# Altium project PCB_ReflowOwen.PrjPcb
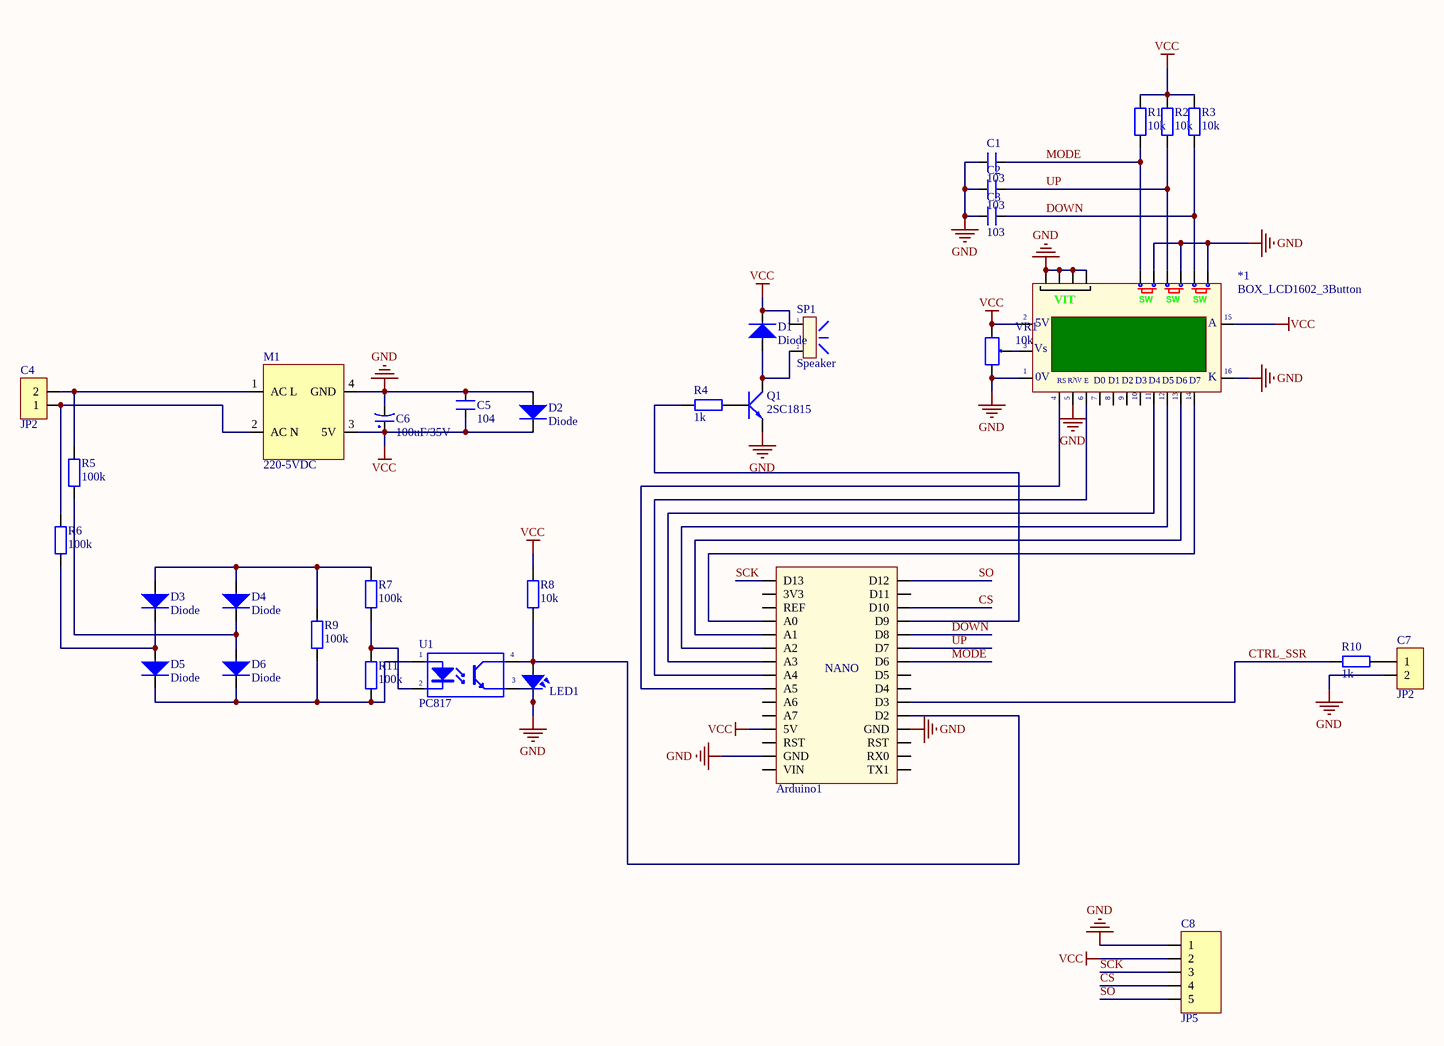
[diagram p0: ReflowOwen.SchDoc]
1 sheet, 33 parts. Net scope: global (net labels, ports and power ports of the same name join across sheets).
Board file: ReflowOwen.PcbDoc

## Sheet ReflowOwen.SchDoc
size A0

### Parts
*1  BOX_LCD1602_3Button  [BOX_LCD1602_3Button]
Arduino1  Arduino Nano  [Arduino Nano]  (value not drawn)
C1  103  [SM-0805]
C2  103  [SM-0805]
C3  103  [SM-0805]
C4  JP2  [JP2-C1T]
C5  104  [CN2]
C6  100uF/35V  [CP1.5/3.4]
C7  JP2  [JP2-C1T]
C8  JP5  [JP5-C1T]
D1  Diode  [DIO-SMD-106]
D2  Diode  [DIO-SMD-106]
D3  Diode  [D1A]
D4  Diode  [D1A]
D5  Diode  [D1A]
D6  Diode  [D1A]
LED1  LED  [LED-5-BLUE]  (value not drawn)
M1  220-5VDC  [5V 700mA 3.5W AC DC]
Q1  2SC1815  [TO92-123]
R1  10k  [RES-1/4W]
R2  10k  [RES-1/4W]
R3  10k  [RES-1/4W]
R4  1k  [RES-1/4W]
R5  100k  [RES-1/4W]
R6  100k  [RES-1/4W]
R7  100k  [RES-1/4W]
R8  10k  [RES-1/4W]
R9  100k  [RES-1/4W]
R10  1k  [RES-1/4W]
R11  100k  [RES-1/4W]
SP1  Speaker  [SPK]
U1  PC817  [DIP4]
VR1  10k  [VR-S2]

### Nets
GND: *1.1(GND) *1.5(R/~{W}) *1.16(K) *1.18 *1.20 *1.22 *1.23 *1.24 *1.25 *1.26 Arduino1.GND C1.1 C2.1 C3.1 C5.2 C6.2 C7.2 C8.1 D2.1 LED1.2 M1.4(GND) Q1.1(E) U1.3(E) VR1.3
VCC: *1.2(VDD) *1.15(A) Arduino1.5V C5.1 C6.1 C8.2 D1.2 D2.2 M1.3(5V) R1.2 R2.2 R3.2 R8.2 SP1.1 VR1.1
CS: Arduino1.D10 C8.4
CTRL_SSR: Arduino1.D3 R10.1
DOWN: *1.21 Arduino1.D8 C3.2 R3.1
MODE: *1.17 Arduino1.D6 C1.2 R1.1
SCK: Arduino1.D13 C8.3
SO: Arduino1.D12 C8.5
UP: *1.19 Arduino1.D7 C2.2 R2.1
Net*1_3: *1.3(VEE) VR1.2
Net*1_4: *1.4(RS) Arduino1.A5
Net*1_6: *1.6(~{EN}) Arduino1.A4
Net*1_11: *1.11(D4) Arduino1.A3
Net*1_12: *1.12(D5) Arduino1.A2
Net*1_13: *1.13(D6) Arduino1.A1
Net*1_14: *1.14(D7) Arduino1.A0
NetArduino1_D2: Arduino1.D2 LED1.1 R8.1 U1.4(C)
NetArduino1_D9: Arduino1.D9 R4.1
NetC4_1: C4.1 M1.2(AC_N) R6.2
NetC4_2: C4.2 M1.1(AC_L) R5.2
NetC7_1: C7.1 R10.2
NetD1_1: D1.1 Q1.2(C) SP1.2
NetD3_1: D3.1 D4.1 R7.2 R9.2
NetD3_2: D3.2 D5.1 R6.1
NetD4_2: D4.2 D6.1 R5.1
NetD5_2: D5.2 D6.2 R9.1 R11.1 U1.1(A)
NetQ1_3: Q1.3(B) R4.2
NetR7_1: R7.1 R11.2 U1.2(K)

Not connected (* = marked no-connect by the designer): *1 7(D0) 8(D1) 9(D2) 10(D3); Arduino1 3V3 A6 A7 D4 D5 D11 REF RST RX0 TX1 VIN

### Notes on the sheet
- (in symbol Arduino Nano) NANO
- (in symbol BOX_LCD1602_3Button) SW; VIT; 5V; Vs; |; 0V; R/W; E

### Library data of the parts
Arduino1 = Arduino Nano: Value: Cau 1A
C1-C3 = CM: Cap SMD; Value: 103
C4 C7 = JP2: WR-PHD 2.54 mm Angled Socket Header; Manufacturer: W¨¹rth Elektronik eiSos GmbH; partNo: 613002143121; ComponentLink1 Description: Manufacturer; ComponentLink2 Description: Datasheet; NoPins: 02; Created Date: 29 March 2013; ComponentLink1URL: http://www.we-online.com; ComponentLink2URL: http://katalog.we-online.de/em/datasheet/6130xx143121.pdf; Created by: Karrer Zheng
C5 = CN2: Cap np 104 => 105pF; Value: 0.1uF
C6 = CP3: Cap 100uF/35V - 470uF/16V; Value: 100uF/35V/50V; Description 1: 1000uF/6,3V - 470uF/16V - 330uF - 25V; Description 2: 220uF/35V - 100uF/50V - 63V - 4,7uF/200V; Description 3: 22uF => 33uF100V - 3,3uF => 4,7uF/250V; Description 4: 2,2uF =>3,3uF/350 - 2,2uF/400V - 1uF/450V
C8 = JP5: WR-PHD 2.54 mm Angled Socket Header; Manufacturer: W¨¹rth Elektronik eiSos GmbH; partNo: 613005143121; ComponentLink1 Description: Manufacturer; ComponentLink2 Description: Datasheet; NoPins: 05; Created Date: 29 March 2013; ComponentLink1URL: http://www.we-online.com; ComponentLink2URL: http://katalog.we-online.de/em/datasheet/6130xx143121.pdf; Created by: Karrer Zheng
LED1 = LED: LED Single colour Green and Red; Value: LED 3 ly Single Colour
M1 = 5V 700mA 3.5W AC 220 to DC
Q1 = 2SC1815: NPN 600mW, ECB; Value: C1815
R1-R11 = R: Resistor R1/4W
SP1 = SPK: Speaker Chip; Value: Speaker Chip
U1 = PC817: Single Opto; Value: PC817
VR1 = Resistor Var